# Altium project 4ADI_2DO.PrjPCB (part 4 of 6)

## Sheet power supply.SchDoc
size A3
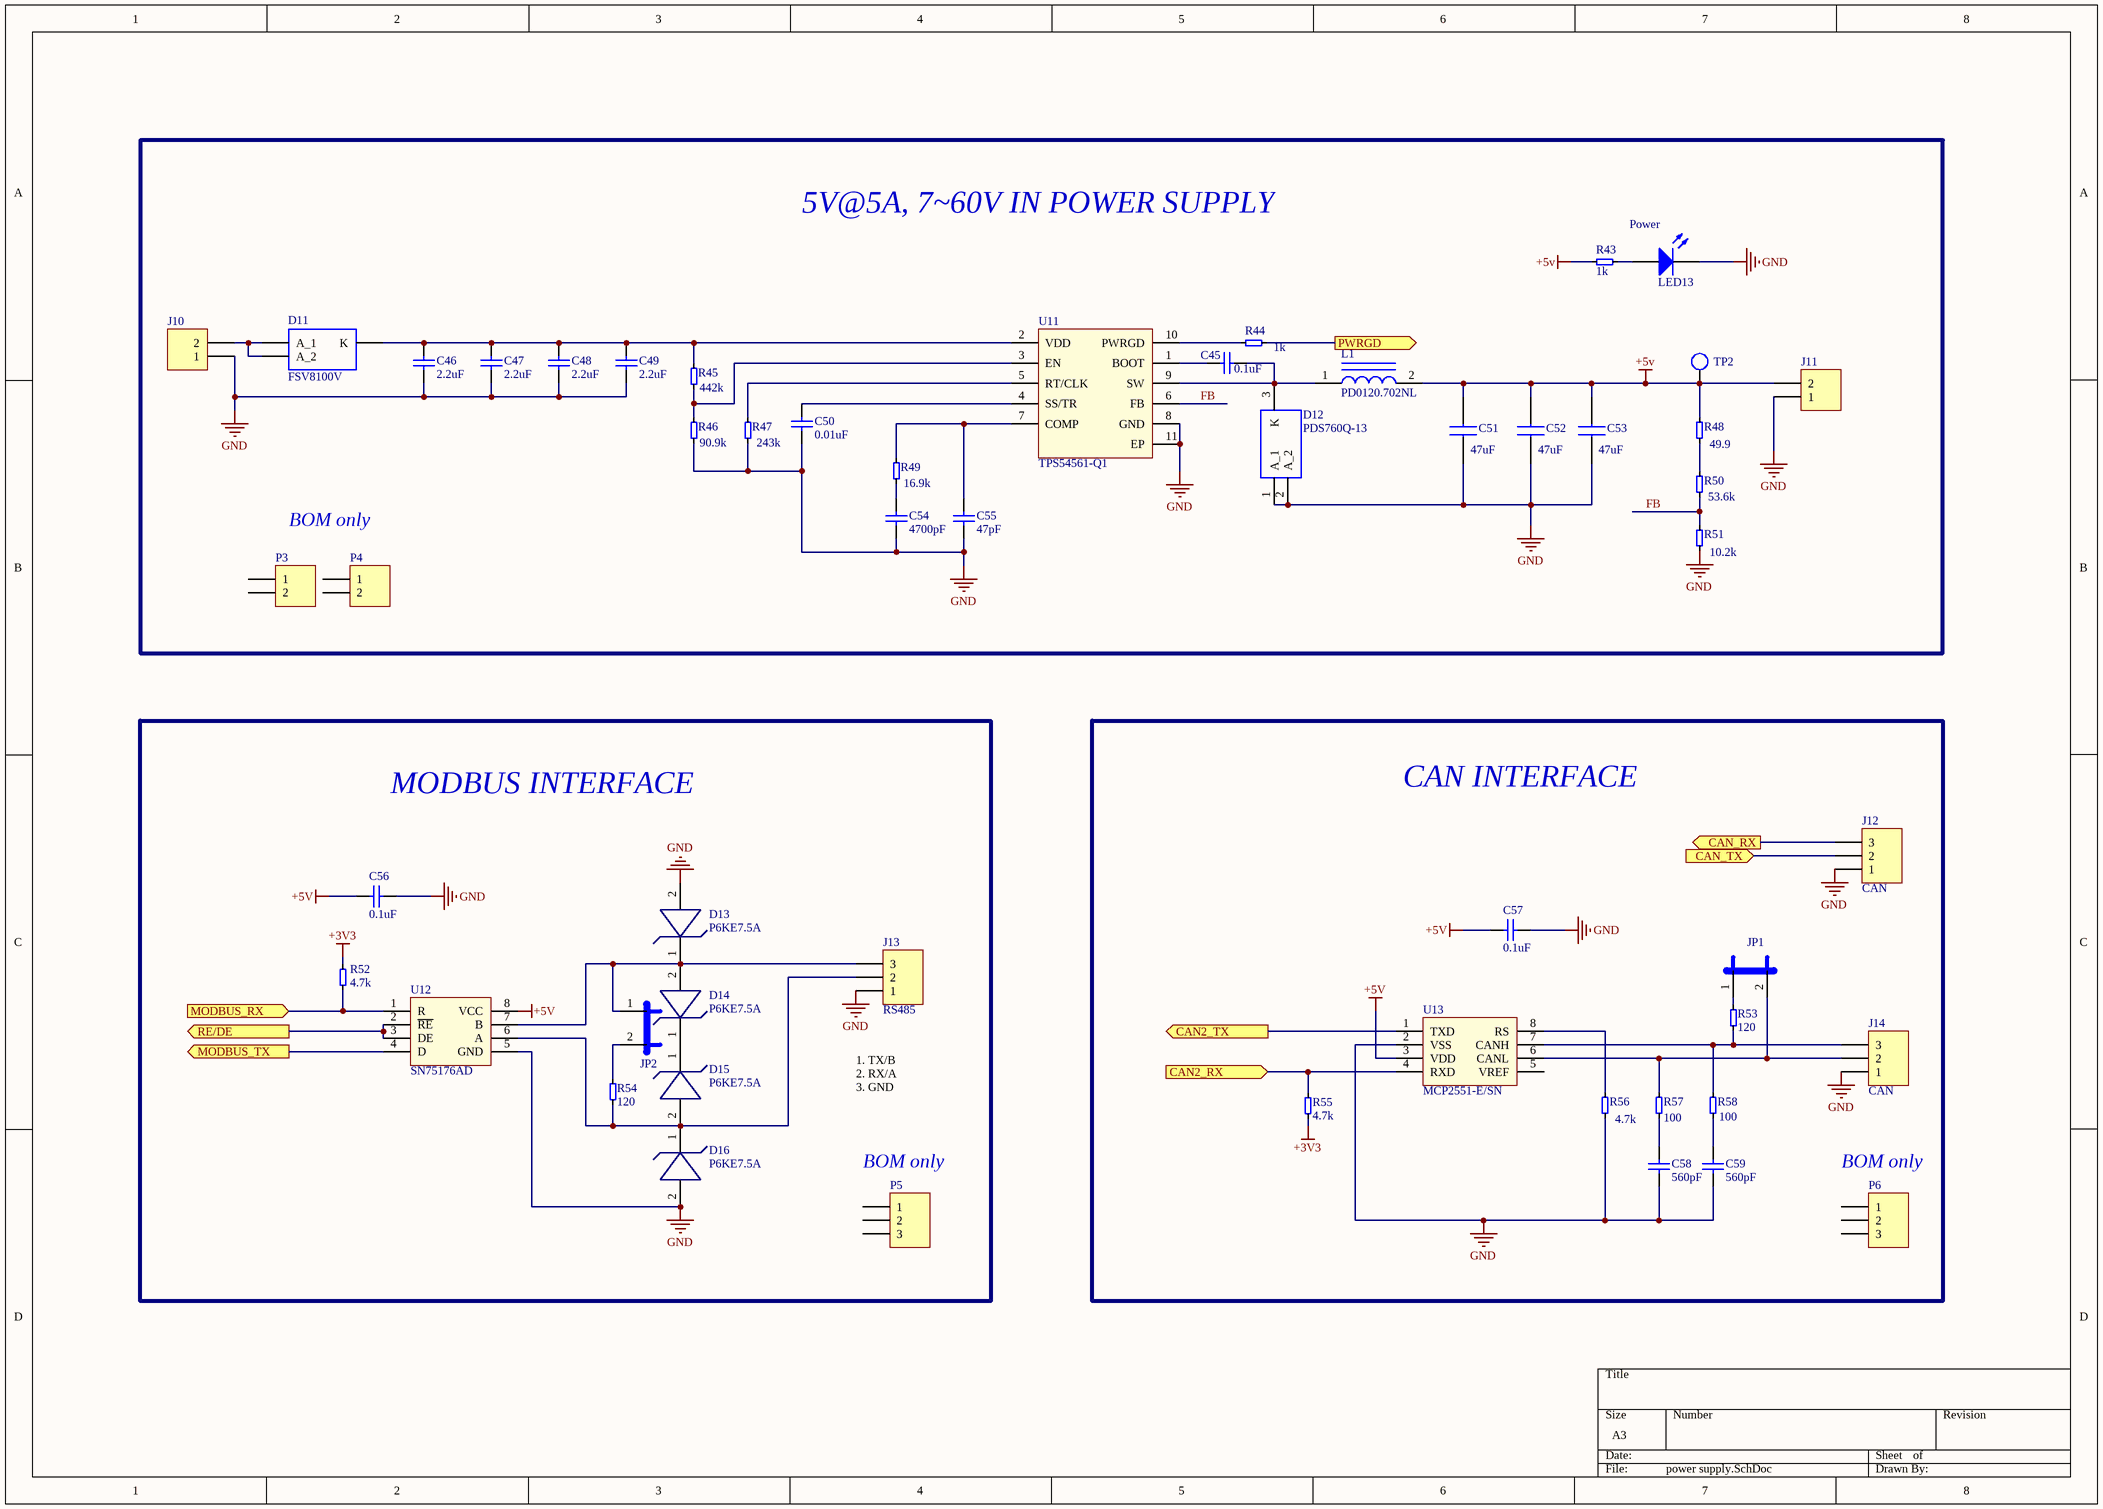
[diagram p4: power supply.SchDoc]

### Parts
C45  0.1uF  [C_ceramic_0603]
C46  2.2uF  [C1210]
C47  2.2uF  [C1210]
C48  2.2uF  [C1210]
C49  2.2uF  [C1210]
C50  0.01uF  [C0603]
C51  47uF  [C1210]
C52  47uF  [C1210]
C53  47uF  [C1210]
C54  4700pF  [C0603]
C55  47pF  [C0603]
C56  0.1uF  [C_ceramic_0603]
C57  0.1uF  [C_ceramic_0603]
C58  560pF  [C0603]
C59  560pF  [C0603]
D11  FSV8100V  [TO-277]
D12  PDS760Q-13  [POWERDI5]
D13  P6KE7.5A  [P6KE7.5A]
D14  P6KE7.5A  [P6KE7.5A]
D15  P6KE7.5A  [P6KE7.5A]
D16  P6KE7.5A  [P6KE7.5A]
J10  CIM025P5  [CON2_P5.08_CIM025P5]  (value not drawn)
J11  CIM025P5  [CON2_P5.08_CIM025P5]  (value not drawn)
J12  CAN  [HDR1X3]
J13  RS485  [CON3_P5.08_CIM035P5]
J14  CAN  [CON3_P5.08_CIM035P5]
JP1  2PIN JUMP_2.54mm  [CNN 2PIN 2.54 JUMP]  (value not drawn)
JP2  2PIN JUMP_2.54mm  [CNN 2PIN 2.54 JUMP]  (value not drawn)
L1  PD0120.702NL  [PD0120.702NL]
LED13  Power  [LED0603_1]
P3  BOM ONLY  (value not drawn)  (mechanical)
P4  BOM ONLY  (value not drawn)  (mechanical)
P5  BOM only_1  (value not drawn)
P6  BOM only_1  (value not drawn)
R43  1k  [R_0603]
R44  1k  [R_0603]
R45  442k  [R_0603]
R46  90.9k  [R_0603]
R47  243k  [R_0603]
R48  49.9  [R_0603]
R49  16.9k  [R_0603]
R50  53.6k  [R_0603]
R51  10.2k  [R_0603]
R52  4.7k  [R_0603]
R53  120  [R_0603]
R54  120  [R_0603]
R55  4.7k  [R_0603]
R56  4.7k  [R_0603]
R57  100  [R_0603]
R58  100  [R_0603]
TP2  Test point  [TP]  (value not drawn)  (no BOM)
U11  TPS54561-Q1  [SON80P400X400X80-11N]
U12  SN75176AD  [SOIC127P600X175-8N]
U13  MCP2551-E/SN  [SOIC127P600X175-8N]

### Ports
CAN2_RX (in), CAN2_TX (out), CAN_RX (out), CAN_TX (in), MODBUS_RX (in), MODBUS_TX (out), PWRGD (out), RE/DE (out)

### Nets
+3V3: R52.2 R55.2
+5v: C51.2(-) C52.2(-) C53.2(-) C56.2 C57.2 J11.2 L1.2 R43.2 R48.2 TP2.1(TP) U12.8(VCC) U13.3(VDD)
GND: C46.1 C47.1 C48.1 C49.1 C50.1 C51.1(+) C52.1(+) C53.1(+) C54.1 C55.1 C56.1 C57.1 C58.1 C59.1 D12.1(A_1) D12.2(A_2) D13.2(NC) D16.2(NC) J10.1 J11.1 J12.1 J13.1 J14.1 LED13.2(K) R46.1 R47.1 R51.1 R56.1 U11.8(GND) U11.11(EP) U12.5(GND) U13.2(VSS)
FB: R50.1 R51.2 U11.6(FB)
NetC45_1: C45.1 U11.1(BOOT)
NetC45_2: C45.2 D12.3(K) L1.1 U11.9(SW)
NetC46_2: C46.2 C47.2 C48.2 C49.2 D11.2(K) R45.2 U11.2(VDD)
NetC50_2: C50.2 U11.4(SS/TR)
NetC54_2: C54.2 R49.1
NetC55_2: C55.2 R49.2 U11.7(COMP)
NetC58_2: C58.2 R57.1
NetC59_2: C59.2 R58.1
NetD11_1: D11.1(A_1) J10.2
NetD13_1: D13.1(K) D14.2(NC) J13.3 JP2.1 U12.7(B)
NetD14_1: D14.1(K) D15.1(K)
NetD15_2: D15.2(NC) D16.1(K) J13.2 R54.1 U12.6(A)
NetJ12_2: J12.2 ; port CAN_TX
NetJ12_3: J12.3 ; port CAN_RX
NetJ14_2: J14.2 JP1.2 R57.2 U13.6(CANL)
NetJ14_3: J14.3 R53.1 R58.2 U13.7(CANH)
NetJP1_1: JP1.1 R53.2
NetJP2_2: JP2.2 R54.2
NetLED13_1: LED13.1(A) R43.1
NetR44_1: R44.1 ; port PWRGD
NetR44_2: R44.2 U11.10(PWRGD)
NetR45_1: R45.1 R46.2 U11.3(EN)
NetR47_2: R47.2 U11.5(RT/CLK)
NetR48_1: R48.1 R50.2
NetR52_1: R52.1 U12.1(R) ; port MODBUS_RX
NetR55_1: R55.1 U13.4(RXD) ; port CAN2_RX
NetR56_2: R56.2 U13.8(RS)
NetU3_60: U12.2(~{RE}) U12.3(DE) ; port RE/DE
NetU3_62: U12.4(D) ; port MODBUS_TX
NetU3_79: U13.1(TXD) ; port CAN2_TX

Not connected (* = marked no-connect by the designer): P3 1 2; P4 1 2; P5 1 2 3; P6 1 2 3; U13 5(VREF)

### Notes on the sheet
- 5V@5A, 7~60V IN POWER SUPPLY
- BOM only
- MODBUS INTERFACE
- CAN INTERFACE
- 1. TX/B
  2. RX/A
  3. GND
- (near P5) BOM only
- (near P6) BOM only

### Library data of the parts
C45 C56 C57 = Cap: CAP CER 0.1UF 50V X7R 0603; Manufacturer: Yageo; Manufacturer Part Number: CC0603KPX7R9BB104; Supplier 1: Digi-Key; Supplier Part Number 1: 311-3567-1-ND
C46-C49 = Cap: CAP CER 2.2UF 100V X7R 1210; Manufacturer: Kyocera AVX; Manufacturer Part Number: 12101C225KAT2A; Tolerance: 10%; Dissipation Factor: 2.5%; Supplier 1: Digi-Key; Supplier Part Number 1: 478-7974-1-ND; Stock 1: 31402; Pricing 1: 1=0.8, 10=0.563, 100=0.3708, 500=0.27464 (USD); Mount: Surface Mount; Case/Package: 1210; Number of Pins: 2; Case Code (Imperial): 1210; Case Code (Metric): 3225; Contact Plating: Tin,Matte; Min Operating Temperature: -55°C; Max Operating Temperature: 125°C; Voltage Rating: 100V; Capacitance: 2.2uF; Package Quantity: 1; Voltage Rating (DC): 100V; Packaging: Tape and Reel; Dielectric: X7R; Termination: SMD/SMT; Voltage: 100V; Length: 3.2mm; Height: 2.79mm; Width: 2.5mm; Thickness: 0.11inch; Depth: 2.5mm; Radiation Hardening: No; Lead Free: Lead Free; REACH SVHC: No SVHC; ComponentLink1URL: http://www.farnell.com/datasheets/1818074.pdf?src-supplier=Element14; ComponentLink1Description: http://www.farnell.com/datasheets/1818074.pdf?src-supplier=Element14; ComponentLink2URL: http://catalogs.avx.com/SurfaceMount.pdf?src-supplier=Digi-Key; ComponentLink2Description: http://catalogs.avx.com/SurfaceMount.pdf?src-supplier=Digi-Key; ComponentLink3URL: http://www.farnell.com/datasheets/1679506.pdf?src-supplier=Element14; ComponentLink3Description: http://www.farnell.com/datasheets/1679506.pdf?src-supplier=Element14
C50 = Cap: CAP CER 10000PF 50V X7R 0603; Manufacturer: Yageo; Manufacturer Part Number: CC0603KRX7R9BB103; Material: Ceramic; Tolerance: 10%; Capacitance: 10nF; Insulation Resistance: 100GR; Supplier 1: Digi-Key; Supplier Part Number 1: 311-1085-1-ND; Stock 1: 8825071; Pricing 1: 1=0.1, 10=0.057, 100=0.0256, 500=0.01826, 1000=0.01435 (USD); Mount: Surface Mount; Case/Package: 0603; Number of Pins: 2; Case Code (Metric): 1608; Case Code (Imperial): 0603; Min Operating Temperature: -55°C; Max Operating Temperature: 125°C; Packaging: Tape and Reel; Voltage Rating: 50V; Voltage Rating (DC): 50V; Package Quantity: 1; Dielectric: X7R; Termination: SMD/SMT; Composition: Ceramic; Voltage: 50V; Length: 1.6mm; Height: 0.8mm; Width: 0.031inch; Thickness: 0.035inch; Depth: 0.8mm; Radiation Hardening: No; REACH SVHC: No SVHC; Lead Free: Lead Free; Halogen Free: Halogen Free; ComponentLink1URL: http://www.farnell.com/datasheets/1734573.pdf?src-supplier=Element14; ComponentLink1Description: http://www.farnell.com/datasheets/1734573.pdf?src-supplier=Element14; ComponentLink2URL: http://www.yageo.com/documents/recent/UPY-GPHC_X7R_6.3V-to-50V_18.pdf?src-supplier=Digi-Key; ComponentLink2Description: http://www.yageo.com/documents/recent/UPY-GPHC_X7R_6.3V-to-50V_18.pdf?src-supplier=Digi-Key; ComponentLink3URL: http://www.farnell.com/datasheets/2167236.pdf?src-supplier=Mouser; ComponentLink3Description: http://www.farnell.com/datasheets/2167236.pdf?src-supplier=Mouser; ComponentLink4URL: http://www.farnell.com/datasheets/70765.pdf?src-supplier=Element14; ComponentLink4Description: http://www.farnell.com/datasheets/70765.pdf?src-supplier=Element14; ComponentLink5URL: http://www.yageo.com/documents/recent/UPY-GPHC_X7R_6.3V-to-50V_8.pdf?src-supplier=Avnet+Europe; ComponentLink5Description: http://www.yageo.com/documents/recent/UPY-GPHC_X7R_6.3V-to-50V_8.pdf?src-supplier=Avnet+Europe; ComponentLink6URL: http://www.farnell.com/datasheets/1489800.pdf?src-supplier=Element14; ComponentLink6Description: http://www.farnell.com/datasheets/1489800.pdf?src-supplier=Element14; ComponentLink7URL: https://www.verical.com/server-webapp/html/getDatasheet?partID=403582&src-supplier=Verical; ComponentLink7Description: https://www.verical.com/server-webapp/html/getDatasheet?partID=403582&src-supplier=Verical
C51-C53 = CAP_UPW1A470MDD1TD: CAP CER 47UF 10V X5R 1210; Manufacturer: Samsung; Manufacturer Part Number: CL32A476MPJNNNE; Tolerance: 20%; Supplier 1: Digi-Key; Supplier Part Number 1: 1276-3380-1-ND; Stock 1: 335104; Pricing 1: 1=0.82, 10=0.602, 100=0.4126, 500=0.32666 (USD); Mount: Surface Mount; Case/Package: 1210; Case Code (Metric): 3225; Case Code (Imperial): 1210; Min Operating Temperature: -55°C; Max Operating Temperature: 85°C; Capacitance: 47uF; Packaging: Tape and Reel; Package Quantity: 1; Voltage Rating: 10V; Dielectric: X5R; Length: 0.126inch; Width: 0.098inch; Thickness: 0.106inch; Depth: 2.5mm; Radiation Hardening: No; ComponentLink1URL: https://www.verical.com/server-webapp/html/getDatasheet?partID=746464&src-supplier=Verical; ComponentLink1Description: https://www.verical.com/server-webapp/html/getDatasheet?partID=746464&src-supplier=Verical; ComponentLink2URL: http://www.samsungsem.com/kr/support/product-search/mlcc/CL32A476MPJNNNE.jsp?src-supplier=Digi-Key; ComponentLink2Description: http://www.samsungsem.com/kr/support/product-search/mlcc/CL32A476MPJNNNE.jsp?src-supplier=Digi-Key
C54 = Cap: CAP CER 4700PF 50V X7R 0603; Manufacturer: Yageo; Manufacturer Part Number: CC0603KRX7R9BB472; Material: Ceramic; Capacitance: 4.7nF; Tolerance: 10%; Insulation Resistance: 10GR; Dissipation Factor: 2.5%; Supplier 1: Digi-Key; Supplier Part Number 1: 311-1083-1-ND; Stock 1: 858972; Pricing 1: 1=0.1, 10=0.057, 100=0.0256, 500=0.01826, 1000=0.01435 (USD); Mount: Surface Mount; Case/Package: 0603; Number of Pins: 2; Case Code (Imperial): 0603; Case Code (Metric): 1608; Dielectric Material: Ceramic; Min Operating Temperature: -55°C; Max Operating Temperature: 125°C; Package Quantity: 1; Voltage Rating: 50V; Voltage Rating (DC): 50V; Packaging: Tape and Reel; Dielectric: X7R; Termination: SMD/SMT; Composition: Ceramic; Voltage: 50V; Length: 1.6mm; Height: 0.8mm; Width: 0.8mm; Thickness: 0.035inch; Depth: 0.8mm; Radiation Hardening: No; REACH SVHC: Unknown; Lead Free: Lead Free; Halogen Free: Halogen Free; ComponentLink1URL: http://www.yageo.com/documents/recent/UPY-GPHC_X7R_6.3V-to-50V_8.pdf?src-supplier=Avnet; ComponentLink1Description: http://www.yageo.com/documents/recent/UPY-GPHC_X7R_6.3V-to-50V_8.pdf?src-supplier=Avnet; ComponentLink2URL: http://www.yageo.com/documents/recent/UPY-GPHC_X7R_6.3V-to-50V_18.pdf?src-supplier=Digi-Key; ComponentLink2Description: http://www.yageo.com/documents/recent/UPY-GPHC_X7R_6.3V-to-50V_18.pdf?src-supplier=Digi-Key; ComponentLink3URL: http://www.yageo.com/documents/recent/UPY-GPHC_X7R_6.3V-to-50V_8.pdf?src-supplier=Avnet+Europe; ComponentLink3Description: http://www.yageo.com/documents/recent/UPY-GPHC_X7R_6.3V-to-50V_8.pdf?src-supplier=Avnet+Europe; ComponentLink4URL: http://www.farnell.com/datasheets/1489800.pdf?src-supplier=Element14; ComponentLink4Description: http://www.farnell.com/datasheets/1489800.pdf?src-supplier=Element14
C55 = Cap: CAP CER 47PF 50V C0G/NPO 0603; Manufacturer: Yageo Phycomp; Manufacturer Part Number: CC0603JRNPO9BN470; Tolerance: 5%; Dielectric: C0G; Temperature Coefficient: 30ppm/°C; Insulation Resistance: 100GR; Supplier 1: Digi-Key; Supplier Part Number 1: 311-1065-1-ND; Stock 1: 429252; Pricing 1: 1=0.1, 10=0.061, 100=0.0273, 500=0.01948, 1000=0.0153 (USD); Mount: Surface Mount; Case/Package: 0603; Number of Pins: 2; Case Code (Imperial): 0603; Case Code (Metric): 1608; Min Operating Temperature: -55°C; Max Operating Temperature: 125°C; Voltage Rating: 50V; Packaging: Tape and Reel; Capacitance: 47pF; Package Quantity: 1; Voltage Rating (DC): 50V; Termination: SMD/SMT; Composition: Ceramic; Voltage: 50V; Length: 1.6mm; Height: 0.8mm; Width: 0.8mm; Thickness: 0.035inch; Depth: 0.8mm; Radiation Hardening: No; REACH SVHC: No SVHC; Lead Free: Lead Free; ComponentLink1URL: http://www.yageo.com/documents/recent/UPY-GP_NP0_16V-to-50V_8.pdf?src-supplier=Avnet; ComponentLink1Description: http://www.yageo.com/documents/recent/UPY-GP_NP0_16V-to-50V_8.pdf?src-supplier=Avnet; ComponentLink2URL: http://www.farnell.com/datasheets/1443161.pdf?src-supplier=Element14; ComponentLink2Description: http://www.farnell.com/datasheets/1443161.pdf?src-supplier=Element14; ComponentLink3URL: http://www.farnell.com/datasheets/1132289.pdf?src-supplier=Farnell; ComponentLink3Description: http://www.farnell.com/datasheets/1132289.pdf?src-supplier=Farnell; ComponentLink4URL: http://www.yageo.com/documents/recent/UPY-GP_NP0_16V-to-50V_16.pdf?src-supplier=Digi-Key; ComponentLink4Description: http://www.yageo.com/documents/recent/UPY-GP_NP0_16V-to-50V_16.pdf?src-supplier=Digi-Key
C58 C59 = Cap: CAP CER 560PF 50V NPO 0603; Manufacturer: Yageo; Manufacturer Part Number: CC0603JRNPO9BN561; Dielectric Material: Ceramic; Tolerance: 5%; Dielectric: C0G; Insulation Resistance: 10GR; Dissipation Factor: 0.1%; Supplier 1: Digi-Key; Supplier Part Number 1: 311-3359-1-ND; Stock 1: 49433; Pricing 1: 1=0.13, 10=0.093, 100=0.0438, 500=0.03074, 1000=0.02545 (USD); Mount: Surface Mount; Case/Package: 0603; Case Code (Imperial): 0603; Case Code (Metric): 1608; Min Operating Temperature: -55°C; Max Operating Temperature: 125°C; Voltage Rating: 50V; Capacitance: 560pF; Voltage Rating (DC): 50V; Packaging: Tape and Reel; Termination: SMD/SMT; Composition: Ceramic; Length: 1.6mm; Height: 0.8mm; Width: 0.8mm; Thickness: 0.035inch; Depth: 0.8mm; Radiation Hardening: No; REACH SVHC: Unknown; Lead Free: Lead Free; ComponentLink1URL: http://www.yageo.com/documents/recent/UPY-GP_NP0_16V-to-50V_8.pdf?src-supplier=Avnet; ComponentLink1Description: http://www.yageo.com/documents/recent/UPY-GP_NP0_16V-to-50V_8.pdf?src-supplier=Avnet; ComponentLink2URL: https://www.verical.com/server-webapp/html/getDatasheet?partID=403539&src-supplier=Verical; ComponentLink2Description: https://www.verical.com/server-webapp/html/getDatasheet?partID=403539&src-supplier=Verical; ComponentLink3URL: http://www.farnell.com/datasheets/1443161.pdf?src-supplier=Element14; ComponentLink3Description: http://www.farnell.com/datasheets/1443161.pdf?src-supplier=Element14
D11 = PDS760Q-13: DIODE SCHOTTKY 100V 8A TO-277; Manufacturer: ON; Supplier 1: Digi-Key; Supplier Part Number 1: FSV8100VCT-ND; Manufacturer Part Number: FSV8100V
D12 = PDS760Q-13: DIODE SCHOTTKY 60V 7A POWERDI5; Manufacturer: Diodes; Element Configuration: Single; Forward Voltage: 560mV; Max Forward Surge Current (Ifsm): 275A; Peak Reverse Current: 20mA; Supplier 1: Digi-Key; Supplier Part Number 1: PDS760Q-13DICT-ND; Manufacturer Part Number: PDS760Q-13; Stock 1: 27556; Pricing 1: 1=0.85, 10=0.76, 100=0.5923, 500=0.48926, 1000=0.38625 (USD); Mount: Surface Mount; Number of Pins: 5; Weight: 0.003386oz; Contact Plating: Tin,Matte; Min Operating Temperature: -65°C; Max Operating Temperature: 150°C; Packaging: Tape and Reel; Average Rectified Current: 7A; Max Repetitive Reverse Voltage (Vrrm): 60V; Package Quantity: 5000; Forward Current: 7A; Peak Non-Repetitive Surge Current: 275A; Max Reverse Voltage (DC): 60V
D13-D16 = ZNR_P6KE7.5A: TVS DIODE 6.4V 11.3V DO214AA; Manufacturer: MCC; Manufacturer Part Number: SMBJP6KE7.5A-TP; Test Current: 10mA; Breakdown Voltage: 7.88V; Polarity: Unidirectional; Peak Pulse Power: 600W; Number of Unidirectional Channels: 1; Min Breakdown Voltage: 7.13V; Power Line Protection: No; Peak Pulse Current: 54A; Leakage Current: 500uA; Supplier 1: Digi-Key; Supplier Part Number 1: SMBJP6KE7.5A-TPMSCT-ND; Stock 1: 1412; Pricing 1: 1=0.46, 10=0.359, 25=0.3024, 100=0.246, 250=0.20388, 500=0.16872, 1000=0.12654 (USD); Mount: Surface Mount; Case/Package: SMB; Number of Pins: 2; Min Operating Temperature: -55°C; Max Operating Temperature: 175°C; Packaging: Tape and Reel; Package Quantity: 1; Clamping Voltage: 11.3V; Reverse Standoff Voltage: 6.4V; Composition: Zener; Max Surge Current: 54A; Number of Channels: 1; Termination: SMD/SMT; Reverse Breakdown Voltage: 7.13V; Number of Elements: 1; Radiation Hardening: No; ComponentLink1URL: http://www.mccsemi.com/up_pdf/SMBJP6KE6.8(C)A-SMBJP6KE550(C)A(DO-214AA).pdf?src-supplier=Digi-Key; ComponentLink1Description: http://www.mccsemi.com/up_pdf/SMBJP6KE6.8(C)A-SMBJP6KE550(C)A(DO-214AA).pdf?src-supplier=Digi-Key
J10 J11 = Header 2: TERM BLK 2P SIDE ENT 5.08MM PCB; Manufacturer: Sauro; Manufacturer Part Number: CIM025P5; Supplier 1: Digi-Key
J12 = Header 3: CONN HEADER VERT 3POS 2.54MM; Manufacturer: Wurth Electronics; Manufacturer Part Number: 61300311121; Number of Positions: 3; Gender: Male; Connector Type: Male Pin; Pitch: 0.1inch; Supplier 1: Digi-Key; Supplier Part Number 1: 732-5316-ND; Stock 1: 146403; Pricing 1: 1=0.13, 10=0.106, 25=0.088, 50=0.074, 100=0.067, 1000=0.061 (USD); Mount: Through Hole; Contact Plating: Gold; Contact Material: Copper; Color: Black; Number of Rows: 1; Packaging: Bulk; Termination: Solder; Number of Contacts: 3; Contact Mating Length: 0.236inch; REACH SVHC: Unknown; Lead Free: Lead Free
J13 J14 P5 P6 = Header 3: Manufacturer: Sauro; Manufacturer Part Number: CIM035P5; Supplier 1: Digi-Key
JP1 JP2 = 2PIN JUMP_2.54mm: CONN HEADER VERT 2POS 2.54MM; Manufacturer: Wurth Electronics; Manufacturer Part Number: 61300211121; Current Rating: 3A; Voltage Rating: 250V; Number of Positions: 2; Gender: Male; Connector Type: Male Pin; Pitch: 0.1inch; Supplier 1: Digi-Key; Supplier Part Number 1: 732-5315-ND; Stock 1: 173337; Pricing 1: 1=0.13, 10=0.106, 25=0.088, 50=0.074, 100=0.067, 1000=0.061 (USD); Mount: Through Hole; Contact Plating: Gold; Housing Material: PBT; Contact Material: Copper Alloy,Copper; Color: Black; Min Operating Temperature: -40°C; Max Operating Temperature: 125°C; Number of Rows: 1; Contact Gender: Male; Packaging: Bulk; Termination: Through Hole; Number of Contacts: 2; Contact Mating Length: 0.236inch; REACH SVHC: Unknown; Lead Free: Lead Free; ComponentLink1URL: http://www.mouser.com/ds/2/445/6130xx11121-538006.pdf?src-supplier=Mouser; ComponentLink1Description: http://www.mouser.com/ds/2/445/6130xx11121-538006.pdf?src-supplier=Mouser
L1 = Inductor Iron: FIXED IND 7.2UH 8.6A 10 MOHM SMD; Manufacturer: Pulse Electronics; Saturation Current: 12.6A; Tolerance: 10%; Shielding: Unshielded; DC Resistance (DCR): 10mR; Supplier 1: Digi-Key; Supplier Part Number 1: 553-2683-ND; Manufacturer Part Number: PD0120.702NL; Stock 1: 1139; Pricing 1: 1=2.93, 90=2.115, 180=1.89, 540=1.53, 1080=1.395, 2520=1.35 (USD); Mount: Surface Mount; Case/Package: Nonstandard; Min Operating Temperature: -40°C; Max Operating Temperature: 125°C; Packaging: Tray; Package Quantity: 90; Current Rating: 8.6A; Inductance: 7.2uH; Max DC Current: 8.6A; Termination: SMD/SMT; Composition: Wirewound; Length: 0.638inch; Height: 0.323inch; Width: 23.87mm; Height - Seated (Max): 0.323inch; Depth: 15.95mm; Radiation Hardening: No
LED13 = LED_0402: LED YELLOW CLEAR CHIP SMD; Manufacturer: Lite-On Inc.; Manufacturer Part Number: LTST-C193KSKT-5A; Supplier 1: Digi-Key; Supplier Part Number 1: 160-1831-1-ND
P3 P4 = Header 2: Plug; Manufacturer: Sauro; Manufacturer Part Number: CIF02005; Supplier 1: Digi-Key
R43 R44 = R_0402: RES SMD 1K OHM 1% 1/10W 0603; Manufacturer: Yageo; Manufacturer Part Number: RC0603FR-071KL; ComponentLink1URL: http://documents.rs-components.com/techlib://itc_doclist_GB.htm?stockno=6186122&src-supplier=RSComponents; ComponentLink1Description: http://documents.rs-components.com/techlib://itc_doclist_GB.htm?stockno=6186122&src-supplier=RSComponents; ComponentLink2URL: http://www.mouser.com/ds/2/447/PYu-RC0402_51_RoHS_L_6_r-8721.pdf?src-supplier=Mouser; ComponentLink2Description: http://www.mouser.com/ds/2/447/PYu-RC0402_51_RoHS_L_6_r-8721.pdf?src-supplier=Mouser; ComponentLink3URL: http://www.yageo.com/documents/recent/PYu-RC0402_51_RoHS_L_6_r.pdf?src-supplier=Future+Electronics; ComponentLink3Description: http://www.yageo.com/documents/recent/PYu-RC0402_51_RoHS_L_6_r.pdf?src-supplier=Future+Electronics; ComponentLink4URL: http://www.farnell.com/datasheets/1018594.pdf?src-supplier=Element14; ComponentLink4Description: http://www.farnell.com/datasheets/1018594.pdf?src-supplier=Element14; ComponentLink5URL: http://www.farnell.com/datasheets/2167052.pdf?src-supplier=Element14; ComponentLink5Description: http://www.farnell.com/datasheets/2167052.pdf?src-supplier=Element14; Supplier 1: Digi-Key; Supplier Part Number 1: 311-1.00KHRCT-ND
R45 = R_0402: RES SMD 442K OHM 1% 1/10W 0603; Manufacturer: Yageo; Manufacturer Part Number: RC0603FR-07442KL; Resistance: 442kR; Power Rating: 100mW; Voltage Rating: 50V; Temperature Coefficient: 100ppm/°C; ComponentLink1URL: http://www.yageo.com/documents/recent/PYu-RC_Group_51_RoHS_L_10.pdf?src-supplier=Digi-Key; ComponentLink1Description: http://www.yageo.com/documents/recent/PYu-RC_Group_51_RoHS_L_10.pdf?src-supplier=Digi-Key; ComponentLink2URL: http://www.yageo.com/documents/recent/PYu-RC0402_51_RoHS_L_6.pdf?src-supplier=Avnet+Europe; ComponentLink2Description: http://www.yageo.com/documents/recent/PYu-RC0402_51_RoHS_L_6.pdf?src-supplier=Avnet+Europe; ComponentLink3URL: http://www.yageo.com/pdf/PYu-RC0402_51_RoHS_L_4.pdf?src-supplier=Avnet; ComponentLink3Description: http://www.yageo.com/pdf/PYu-RC0402_51_RoHS_L_4.pdf?src-supplier=Avnet; Supplier 1: Digi-Key; Supplier Part Number 1: 311-442KHRCT-ND; Stock 1: 227853; Pricing 1: 1=0.1, 10=0.023, 100=0.0094, 1000=0.00421, 2500=0.00366 (USD); Case/Package: 0603; Case Code (Metric): 1608; Case Code (Imperial): 0603; Min Operating Temperature: -55°C; Max Operating Temperature: 155°C; Tolerance: 1%; Package Quantity: 1; Packaging: Tape and Reel; Composition: Thick Film; Number of Terminations: 2; Termination: SMD/SMT; Military Standard: Not; Max Power Dissipation: 100mW; Voltage Rating (DC): 50V; Features: Moisture Resistant; Length: 1.6mm; Height: 0.022inch; Width: 0.031inch; Depth: 0.8mm; Lead Free: Lead Free; ComponentLink4URL: http://www.yageo.com/documents/recent/PYu-RC_Group_51_RoHS_L_9.pdf?src-supplier=Digi-Key; ComponentLink4Description: http://www.yageo.com/documents/recent/PYu-RC_Group_51_RoHS_L_9.pdf?src-supplier=Digi-Key; ComponentLink5URL: http://www.mouser.com/catalog/specsheets/RC0603.pdf?src-supplier=Mouser; ComponentLink5Description: http://www.mouser.com/catalog/specsheets/RC0603.pdf?src-supplier=Mouser
R46 = R_0402: RES SMD 90.9K OHM 1% 1/10W 0603; Manufacturer: Yageo; Manufacturer Part Number: RC0603FR-0790K9L; Resistance: 90.9kR; Voltage Rating (DC): 50V; Power Rating: 100mW; Voltage Rating: 75V; Temperature Coefficient: 100ppm/°C; ComponentLink1URL: http://www.yageo.com/documents/recent/PYu-RC_Group_51_RoHS_L_9.pdf?src-supplier=Verical; ComponentLink1Description: http://www.yageo.com/documents/recent/PYu-RC_Group_51_RoHS_L_9.pdf?src-supplier=Verical; ComponentLink2URL: http://www.yageo.com/documents/recent/PYu-RC_Group_51_RoHS_L_9.pdf?src-supplier=Mouser; ComponentLink2Description: http://www.yageo.com/documents/recent/PYu-RC_Group_51_RoHS_L_9.pdf?src-supplier=Mouser; Supplier 1: Digi-Key; Supplier Part Number 1: 311-90.9KHRCT-ND; Stock 1: 1879816; Pricing 1: 1=0.1, 10=0.023, 100=0.0094, 1000=0.00421, 2500=0.00366 (USD); Case/Package: 0603; Weight: 7.1E-05oz; Case Code (Imperial): 0603; Case Code (Metric): 1608; Min Operating Temperature: -55°C; Max Operating Temperature: 155°C; Tolerance: 1%; Packaging: Tape and Reel; Termination: SMD/SMT; Composition: Thick Film; Military Standard: Not; Length: 1.6mm; Height: 0.45mm; Width: 0.8mm; Depth: 0.8mm; Lead Free: Lead Free; ComponentLink3URL: https://www.verical.com/server-webapp/html/getDatasheet?partID=325203&src-supplier=Verical; ComponentLink3Description: https://www.verical.com/server-webapp/html/getDatasheet?partID=325203&src-supplier=Verical
R47 = R_0402: RES SMD 243K OHM 1% 1/10W 0603; Manufacturer: Yageo; Manufacturer Part Number: RC0603FR-07243KL; Power Rating: 100mW; Resistance: 243kR; Voltage Rating: 50V; Temperature Coefficient: 100ppm/°C; Working Voltage: 75V; ComponentLink1URL: http://www.yageo.com/documents/recent/PYu-RC0402_51_RoHS_L_6.pdf?src-supplier=Avnet; ComponentLink1Description: http://www.yageo.com/documents/recent/PYu-RC0402_51_RoHS_L_6.pdf?src-supplier=Avnet; ComponentLink2URL: http://www.mouser.com/ds/2/447/PYu-RC0402_51_RoHS_L_6_r-8721.pdf?src-supplier=Mouser; ComponentLink2Description: http://www.mouser.com/ds/2/447/PYu-RC0402_51_RoHS_L_6_r-8721.pdf?src-supplier=Mouser; ComponentLink3URL: http://www.yageo.com/documents/recent/PYu-RC0402_51_RoHS_L_6.pdf?src-supplier=Avnet+Europe; ComponentLink3Description: http://www.yageo.com/documents/recent/PYu-RC0402_51_RoHS_L_6.pdf?src-supplier=Avnet+Europe; Supplier 1: Digi-Key; Supplier Part Number 1: 311-243KHRCT-ND; Stock 1: 376039; Pricing 1: 1=0.1, 10=0.023, 100=0.0094, 1000=0.00421, 2500=0.00366 (USD); Case/Package: 0603; Case Code (Imperial): 0603; Case Code (Metric): 1608; Min Operating Temperature: -55°C; Max Operating Temperature: 155°C; Packaging: Tape and Reel; Tolerance: 1%; Termination: SMD/SMT; Composition: Thick Film; Military Standard: Not; Voltage Rating (DC): 50V; Package Quantity: 1; Number of Terminations: 2; Max Power Dissipation: 100mW; Features: Moisture Resistant; Length: 1.6mm; Height: 0.022inch; Width: 0.8mm; Depth: 0.8mm; Lead Free: Lead Free; ComponentLink4URL: http://www.mouser.com/catalog/specsheets/RC0603.pdf?src-supplier=Mouser; ComponentLink4Description: http://www.mouser.com/catalog/specsheets/RC0603.pdf?src-supplier=Mouser; ComponentLink5URL: http://www.yageo.com.tw/exep/pages/download/literatures/PYu-R_INT-thick_7.pdf?src-supplier=Digi-Key; ComponentLink5Description: http://www.yageo.com.tw/exep/pages/download/literatures/PYu-R_INT-thick_7.pdf?src-supplier=Digi-Key; ComponentLink6URL: http://www.yageo.com/documents/recent/PYu-RC_Group_51_RoHS_L_10.pdf?src-supplier=Digi-Key; ComponentLink6Description: http://www.yageo.com/documents/recent/PYu-RC_Group_51_RoHS_L_10.pdf?src-supplier=Digi-Key; ComponentLink7URL: http://www.yageo.com/documents/recent/PYu-RC_Group_51_RoHS_L_9.pdf?src-supplier=Digi-Key; ComponentLink7Description: http://www.yageo.com/documents/recent/PYu-RC_Group_51_RoHS_L_9.pdf?src-supplier=Digi-Key
R48 = R_0402: RES SMD 49.9 OHM 1% 1/10W 0603; Manufacturer: Yageo; Manufacturer Part Number: RC0603FR-0749R9L; Resistance: 49.9R; Power Rating: 100mW; Temperature Coefficient: 100ppm/°C; Voltage Rating (DC): 50V; ComponentLink1URL: http://documents.rs-components.com/techlib://itc_doclist_GB.htm?stockno=6184536&src-supplier=RSComponents; ComponentLink1Description: http://documents.rs-components.com/techlib://itc_doclist_GB.htm?stockno=6184536&src-supplier=RSComponents; ComponentLink2URL: http://www.farnell.com/datasheets/2167052.pdf?src-supplier=Element14; ComponentLink2Description: http://www.farnell.com/datasheets/2167052.pdf?src-supplier=Element14; ComponentLink3URL: http://www.yageo.com/documents/recent/PYu-RC0402_51_RoHS_L_6_r.pdf?src-supplier=Future+Electronics; ComponentLink3Description: http://www.yageo.com/documents/recent/PYu-RC0402_51_RoHS_L_6_r.pdf?src-supplier=Future+Electronics; ComponentLink4URL: http://www.farnell.com/datasheets/1018594.pdf?src-supplier=Element14; ComponentLink4Description: http://www.farnell.com/datasheets/1018594.pdf?src-supplier=Element14; ComponentLink5URL: http://www.yageo.com/documents/recent/PYu-RC_Group_51_RoHS_L_10.pdf?src-supplier=Digi-Key; ComponentLink5Description: http://www.yageo.com/documents/recent/PYu-RC_Group_51_RoHS_L_10.pdf?src-supplier=Digi-Key; Supplier 1: Digi-Key; Supplier Part Number 1: 311-49.9HRCT-ND; Stock 1: 9614882; Pricing 1: 1=0.1, 10=0.023, 100=0.0094, 1000=0.00421, 2500=0.00366 (USD); Case/Package: 0603; Number of Pins: 2; Case Code (Imperial): 0603; Case Code (Metric): 1608; Min Operating Temperature: -55°C; Max Operating Temperature: 155°C; Packaging: Tape and Reel; Tolerance: 1%; Military Standard: Not; Composition: Thick Film; Voltage Rating: 50V; Termination: SMD/SMT; Length: 1.6mm; Height: 0.45mm; Depth: 0.8mm; Lead Free: Lead Free; REACH SVHC: No SVHC; ComponentLink6URL: https://www.verical.com/server-webapp/html/getDatasheet?partID=325421&src-supplier=Verical; ComponentLink6Description: https://www.verical.com/server-webapp/html/getDatasheet?partID=325421&src-supplier=Verical; ComponentLink7URL: http://documents.rs-components.com/techlib://itc_doclist_GB.htm?stockno=5047565&src-supplier=RSComponents; ComponentLink7Description: http://documents.rs-components.com/techlib://itc_doclist_GB.htm?stockno=5047565&src-supplier=RSComponents
R49 = R_0402: RES SMD 16.9K OHM 1% 1/10W 0603; Manufacturer: Yageo; Manufacturer Part Number: RC0603FR-0716K9L; Resistance: 16.9kR; Power Rating: 100mW; Temperature Coefficient: 100ppm/°C; Voltage Rating (DC): 50V; ComponentLink1URL: http://www.yageo.com/documents/recent/PYu-RC0402_51_RoHS_L_6.pdf?src-supplier=Avnet+Europe; ComponentLink1Description: http://www.yageo.com/documents/recent/PYu-RC0402_51_RoHS_L_6.pdf?src-supplier=Avnet+Europe; ComponentLink2URL: http://www.mouser.com/ds/2/447/PYu-RC0402_51_RoHS_L_6_r-8721.pdf?src-supplier=Mouser; ComponentLink2Description: http://www.mouser.com/ds/2/447/PYu-RC0402_51_RoHS_L_6_r-8721.pdf?src-supplier=Mouser; ComponentLink3URL: http://www.yageo.com/documents/recent/PYu-RC0402_51_RoHS_L_6_r.pdf?src-supplier=Future+Electronics; ComponentLink3Description: http://www.yageo.com/documents/recent/PYu-RC0402_51_RoHS_L_6_r.pdf?src-supplier=Future+Electronics; Supplier 1: Digi-Key; Supplier Part Number 1: 311-16.9KHRCT-ND; Stock 1: 886707; Pricing 1: 1=0.1, 10=0.023, 100=0.0094, 1000=0.00421, 2500=0.00366 (USD); Case/Package: 0603; Case Code (Metric): 1608; Case Code (Imperial): 0603; Min Operating Temperature: -55°C; Max Operating Temperature: 155°C; Tolerance: 1%; Packaging: Tape and Reel; Composition: Thick Film; Number of Terminations: 2; Military Standard: Not; Package Quantity: 1; Voltage Rating: 50V; Termination: SMD/SMT; Max Power Dissipation: 100mW; Features: Moisture Resistant; Length: 1.6mm; Height: 0.022inch; Depth: 0.8mm; Width: 0.031inch; Lead Free: Lead Free; ComponentLink4URL: http://www.yageo.com/documents/recent/PYu-RC_Group_51_RoHS_L_9.pdf?src-supplier=Digi-Key; ComponentLink4Description: http://www.yageo.com/documents/recent/PYu-RC_Group_51_RoHS_L_9.pdf?src-supplier=Digi-Key; ComponentLink5URL: http://www.yageo.com/documents/recent/PYu-RC_Group_51_RoHS_L_10.pdf?src-supplier=Digi-Key; ComponentLink5Description: http://www.yageo.com/documents/recent/PYu-RC_Group_51_RoHS_L_10.pdf?src-supplier=Digi-Key; ComponentLink6URL: http://www.mouser.com/catalog/specsheets/RC0603.pdf?src-supplier=Mouser; ComponentLink6Description: http://www.mouser.com/catalog/specsheets/RC0603.pdf?src-supplier=Mouser
R50 = R_0402: RES SMD 53.6K OHM 1% 1/10W 0603; Manufacturer: Yageo; Manufacturer Part Number: RC0603FR-0753K6L; Resistance: 53.6kR; Temperature Coefficient: 100ppm/°C; Voltage Rating (DC): 50V; Power Rating: 100mW; ComponentLink1URL: http://www.yageo.com/documents/recent/PYu-RC0402_51_RoHS_L_6.pdf?src-supplier=Avnet; ComponentLink1Description: http://www.yageo.com/documents/recent/PYu-RC0402_51_RoHS_L_6.pdf?src-supplier=Avnet; ComponentLink2URL: http://www.yageo.com/documents/recent/PYu-RC_Group_51_RoHS_L_10.pdf?src-supplier=Digi-Key; ComponentLink2Description: http://www.yageo.com/documents/recent/PYu-RC_Group_51_RoHS_L_10.pdf?src-supplier=Digi-Key; ComponentLink3URL: http://www.yageo.com/documents/recent/PYu-RC0402_51_RoHS_L_6_r.pdf?src-supplier=Mouser; ComponentLink3Description: http://www.yageo.com/documents/recent/PYu-RC0402_51_RoHS_L_6_r.pdf?src-supplier=Mouser; Supplier 1: Digi-Key; Supplier Part Number 1: 311-53.6KHRCT-ND; Stock 1: 661818; Pricing 1: 1=0.1, 10=0.023, 100=0.0094, 1000=0.00421, 2500=0.00366 (USD); Mount: Surface Mount; Case/Package: 0603; Case Code (Imperial): 0603; Case Code (Metric): 1608; Min Operating Temperature: -55°C; Max Operating Temperature: 155°C; Packaging: Tape and Reel; Tolerance: 1%; Composition: Thick Film; Voltage Rating: 50V; Termination: SMD/SMT; Military Standard: Not; Length: 1.6mm; Height: 0.45mm; Depth: 0.8mm; Lead Free: Lead Free; ComponentLink4URL: http://documents.rs-components.com/techlib://itc_doclist_GB.htm?stockno=5047745&src-supplier=RSComponents; ComponentLink4Description: http://documents.rs-components.com/techlib://itc_doclist_GB.htm?stockno=5047745&src-supplier=RSComponents
R51 = R_0402: RES SMD 10.2K OHM 1% 1/10W 0603; Manufacturer: Yageo; Manufacturer Part Number: RC0603FR-0710K2L; Resistance: 10.2kR; Power Rating: 100mW; Voltage Rating: 75V; Temperature Coefficient: 100ppm/°C; Voltage Rating (DC): 50V; ComponentLink1URL: https://www.verical.com/server-webapp/html/getDatasheet?partID=327827&src-supplier=Verical; ComponentLink1Description: https://www.verical.com/server-webapp/html/getDatasheet?partID=327827&src-supplier=Verical; ComponentLink2URL: http://www.yageo.com/pdf/PYu-RC0402_51_RoHS_L_4.pdf?src-supplier=Avnet; ComponentLink2Description: http://www.yageo.com/pdf/PYu-RC0402_51_RoHS_L_4.pdf?src-supplier=Avnet; ComponentLink3URL: http://www.yageo.com/documents/recent/PYu-RC0402_51_RoHS_L_6.pdf?src-supplier=Avnet+Europe; ComponentLink3Description: http://www.yageo.com/documents/recent/PYu-RC0402_51_RoHS_L_6.pdf?src-supplier=Avnet+Europe; ComponentLink4URL: http://www.yageo.com/documents/recent/PYu-RC0402_51_RoHS_L_6_r.pdf?src-supplier=Future+Electronics; ComponentLink4Description: http://www.yageo.com/documents/recent/PYu-RC0402_51_RoHS_L_6_r.pdf?src-supplier=Future+Electronics; Supplier 1: Digi-Key; Supplier Part Number 1: 311-10.2KHRCT-ND; Stock 1: 691246; Pricing 1: 1=0.1, 10=0.023, 100=0.0094, 1000=0.00421, 2500=0.00366 (USD); Mount: Surface Mount; Case/Package: 0603; Weight: 7.1E-05oz; Case Code (Metric): 1608; Case Code (Imperial): 0603; Min Operating Temperature: -55°C; Max Operating Temperature: 155°C; Tolerance: 1%; Packaging: Tape and Reel; Composition: Thick Film; Termination: SMD/SMT; Military Standard: Not; Package Quantity: 1; Number of Terminations: 2; Max Power Dissipation: 100mW; Features: Moisture Resistant; Length: 1.6mm; Height: 0.45mm; Depth: 0.8mm; Width: 0.031inch; Lead Free: Lead Free; ComponentLink5URL: http://www.yageo.com/documents/recent/PYu-RC_Group_51_RoHS_L_10.pdf?src-supplier=Digi-Key; ComponentLink5Description: http://www.yageo.com/documents/recent/PYu-RC_Group_51_RoHS_L_10.pdf?src-supplier=Digi-Key; ComponentLink6URL: http://documents.rs-components.com/techlib://itc_doclist_GB.htm?stockno=5049022&src-supplier=RSComponents; ComponentLink6Description: http://documents.rs-components.com/techlib://itc_doclist_GB.htm?stockno=5049022&src-supplier=RSComponents
R52 R55 R56 = R_0402: RES SMD 4.7K OHM 1% 1/10W 0603; Manufacturer: Yageo Phycomp; Manufacturer Part Number: RC0603FR-074K7L; Temperature Coefficient: 100ppm/°C; Voltage Rating (DC): 50V; Resistance: 4.7kR; Power Rating: 100mW; ComponentLink1URL: http://documents.rs-components.com/techlib://itc_doclist_GB.htm?stockno=6184558&src-supplier=RSComponents; ComponentLink1Description: http://documents.rs-components.com/techlib://itc_doclist_GB.htm?stockno=6184558&src-supplier=RSComponents; ComponentLink2URL: http://www.farnell.com/datasheets/1018594.pdf?src-supplier=Element14; ComponentLink2Description: http://www.farnell.com/datasheets/1018594.pdf?src-supplier=Element14; ComponentLink3URL: https://www.verical.com/server-webapp/html/getDatasheet?partID=328119&src-supplier=Verical; ComponentLink3Description: https://www.verical.com/server-webapp/html/getDatasheet?partID=328119&src-supplier=Verical; ComponentLink4URL: http://www.farnell.com/datasheets/1686128.pdf?src-supplier=Element14; ComponentLink4Description: http://www.farnell.com/datasheets/1686128.pdf?src-supplier=Element14; Supplier 1: Digi-Key; Supplier Part Number 1: 311-4.70KHRCT-ND; Stock 1: 15266985; Pricing 1: 1=0.1, 10=0.023, 100=0.0094, 1000=0.00421, 2500=0.00366 (USD); Mount: Surface Mount; Case/Package: 0603; Number of Pins: 2; Min Operating Temperature: -55°C; Max Operating Temperature: 155°C; Tolerance: 1%; Packaging: Cut Tape; Length: 1.6mm; Height: 0.45mm; Width: 800um; Depth: 0.8mm; REACH SVHC: No SVHC; Lead Free: Lead Free
R53 R54 = R_0402: RES SMD 120 OHM 1% 1/10W 0603; Manufacturer: Yageo; Manufacturer Part Number: RC0603FR-07120RL; Resistance: 120R; Temperature Coefficient: 100ppm/°C; Voltage Rating (DC): 50V; Power Rating: 100mW; ComponentLink1URL: http://www.farnell.com/datasheets/1018594.pdf?src-supplier=Element14; ComponentLink1Description: http://www.farnell.com/datasheets/1018594.pdf?src-supplier=Element14; ComponentLink2URL: http://www.mouser.com/ds/2/447/PYu-RC0402_51_RoHS_L_6_r-8721.pdf?src-supplier=Mouser; ComponentLink2Description: http://www.mouser.com/ds/2/447/PYu-RC0402_51_RoHS_L_6_r-8721.pdf?src-supplier=Mouser; ComponentLink3URL: http://documents.rs-components.com/techlib://itc_doclist_GB.htm?stockno=6185898&src-supplier=RSComponents; ComponentLink3Description: http://documents.rs-components.com/techlib://itc_doclist_GB.htm?stockno=6185898&src-supplier=RSComponents; ComponentLink4URL: http://www.yageo.com/documents/recent/PYu-RC_Group_51_RoHS_L_10.pdf?src-supplier=Digi-Key; ComponentLink4Description: http://www.yageo.com/documents/recent/PYu-RC_Group_51_RoHS_L_10.pdf?src-supplier=Digi-Key; ComponentLink5URL: http://www.yageo.com/documents/recent/PYu-RC0402_51_RoHS_L_6_r.pdf?src-supplier=Future+Electronics; ComponentLink5Description: http://www.yageo.com/documents/recent/PYu-RC0402_51_RoHS_L_6_r.pdf?src-supplier=Future+Electronics; Supplier 1: Digi-Key; Supplier Part Number 1: 311-120HRCT-ND; Stock 1: 2588202; Pricing 1: 1=0.1, 10=0.023, 100=0.0094, 1000=0.00421, 2500=0.00366 (USD); Case/Package: 0603; Number of Pins: 2; Case Code (Metric): 1608; Case Code (Imperial): 0603; Min Operating Temperature: -55°C; Max Operating Temperature: 155°C; Tolerance: 1%; Composition: Thick Film; Packaging: Tape and Reel; Voltage Rating: 50V; Package Quantity: 1; Number of Terminations: 2; Termination: SMD/SMT; Military Standard: Not; Max Power Dissipation: 100mW; Features: Moisture Resistant; Length: 1.6mm; Height: 0.022inch; Width: 0.031inch; Depth: 0.8mm; REACH SVHC: No SVHC; Lead Free: Lead Free; ComponentLink6URL: http://www.farnell.com/datasheets/2167052.pdf?src-supplier=Element14; ComponentLink6Description: http://www.farnell.com/datasheets/2167052.pdf?src-supplier=Element14; ComponentLink7URL: http://www.farnell.com/datasheets/1868787.pdf?src-supplier=Element14; ComponentLink7Description: http://www.farnell.com/datasheets/1868787.pdf?src-supplier=Element14; ComponentLink8URL: http://www.farnell.com/datasheets/443971.pdf?src-supplier=Element14; ComponentLink8Description: http://www.farnell.com/datasheets/443971.pdf?src-supplier=Element14
R57 R58 = R_0402: RES SMD 100 OHM 1% 1/10W 0603; Manufacturer: Yageo; Manufacturer Part Number: RC0603FR-07100RL; Voltage Rating (DC): 50V; Resistance: 100R; Temperature Coefficient: 100ppm/°C; Power Rating: 100mW; ComponentLink1URL: http://www.farnell.com/datasheets/1784430.pdf?src-supplier=Element14; ComponentLink1Description: http://www.farnell.com/datasheets/1784430.pdf?src-supplier=Element14; ComponentLink2URL: http://www.yageo.com/documents/recent/PYu-RC_Group_51_RoHS_L_9.pdf?src-supplier=Mouser; ComponentLink2Description: http://www.yageo.com/documents/recent/PYu-RC_Group_51_RoHS_L_9.pdf?src-supplier=Mouser; ComponentLink3URL: http://www.yageo.com/documents/recent/PYu-RC0402_51_RoHS_L_6_r.pdf?src-supplier=Future+Electronics; ComponentLink3Description: http://www.yageo.com/documents/recent/PYu-RC0402_51_RoHS_L_6_r.pdf?src-supplier=Future+Electronics; ComponentLink4URL: https://www.verical.com/server-webapp/html/getDatasheet?partID=329466&src-supplier=Verical; ComponentLink4Description: https://www.verical.com/server-webapp/html/getDatasheet?partID=329466&src-supplier=Verical; ComponentLink5URL: http://www.farnell.com/datasheets/1018594.pdf?src-supplier=Element14; ComponentLink5Description: http://www.farnell.com/datasheets/1018594.pdf?src-supplier=Element14; ComponentLink6URL: http://www.farnell.com/datasheets/2167052.pdf?src-supplier=Element14; ComponentLink6Description: http://www.farnell.com/datasheets/2167052.pdf?src-supplier=Element14; ComponentLink7URL: http://documents.rs-components.com/techlib://itc_doclist_GB.htm?stockno=6185810&src-supplier=RSComponents; ComponentLink7Description: http://documents.rs-components.com/techlib://itc_doclist_GB.htm?stockno=6185810&src-supplier=RSComponents; Supplier 1: Digi-Key; Supplier Part Number 1: 311-100HRCT-ND; Stock 1: 22661122; Pricing 1: 1=0.1, 10=0.021, 100=0.0084, 1000=0.00376, 2500=0.00327 (USD); Case/Package: 0603; Number of Pins: 2; Case Code (Imperial): 0603; Case Code (Metric): 1608; Min Operating Temperature: -55°C; Max Operating Temperature: 155°C; Tolerance: 1%; Packaging: Tape and Reel; Composition: Thick Film; Voltage Rating: 50V; Termination: SMD/SMT; Military Standard: Not; Length: 1.6mm; Height: 0.45mm; Width: 0.8mm; Depth: 0.8mm; REACH SVHC: Unknown; Lead Free: Lead Free; ComponentLink8URL: http://www.farnell.com/datasheets/1868787.pdf?src-supplier=Element14; ComponentLink8Description: http://www.farnell.com/datasheets/1868787.pdf?src-supplier=Element14; ComponentLink9URL: http://documents.rs-components.com/techlib://itc_doclist_GB.htm?stockno=5048912&src-supplier=RSComponents; ComponentLink9Description: http://documents.rs-components.com/techlib://itc_doclist_GB.htm?stockno=5048912&src-supplier=RSComponents; ComponentLink10URL: http://www.farnell.com/datasheets/443971.pdf?src-supplier=Element14; ComponentLink10Description: http://www.farnell.com/datasheets/443971.pdf?src-supplier=Element14
U11 = TPS54561-Q1: IC REG BCK SPLIT RAIL ADJ 10WSON; Manufacturer: Texas Instruments; Manufacturer Part Number: TPS54561DPRR; Switching Frequency: 2.5MHz; Number of Outputs: 1; Output Voltage: 59V; Max Output Current: 5A; Min Input Voltage: 4.5V; Max Input Voltage: 60V; Synchronous Rectifier: No; Min Output Voltage: 800mV; Quiescent Current: 152uA; Output Type: Adjustable; Output Configuration: Positive; Supplier 1: Digi-Key; Supplier Part Number 1: 296-40803-1-ND; Stock 1: 14195; Pricing 1: 1=5.52, 10=4.962, 100=4.0652, 500=3.46064, 1000=2.91861 (USD); Mount: Surface Mount; Number of Pins: 10; Min Operating Temperature: -40°C; Max Operating Temperature: 125°C; Package Quantity: 3000; Packaging: Tape and Reel; Output Current: 5A; Max Output Voltage: 59V; Operating Supply Voltage: 60V; Radiation Hardening: No; Lead Free: Lead Free; ComponentLink1URL: http://www.ti.com/lit/ds/symlink/tps54561.pdf?src-supplier=Digi-Key; ComponentLink1Description: http://www.ti.com/lit/ds/symlink/tps54561.pdf?src-supplier=Digi-Key; ComponentLink2URL: http://www.ti.com/lit/ds/symlink/tps54561.pdf?src-supplier=Avnet; ComponentLink2Description: http://www.ti.com/lit/ds/symlink/tps54561.pdf?src-supplier=Avnet
U12 = SN75176AD: IC DIFF BUS TXRX 8-SOIC; Manufacturer: Texas Instruments; Manufacturer Part Number: SN75176ADR; Number of Receivers: 1; Operating Supply Voltage: 5V; Min Supply Voltage: 4.75V; Max Supply Voltage: 5.25V; Nominal Supply Current: 50mA; Data Rate: 10Mbps; Logic Function: Transceiver; Simplex/Duplex: Half Duplex; ESD Protection: No; Supplier 1: Digi-Key; Supplier Part Number 1: 296-14955-1-ND; Stock 1: 24477; Pricing 1: 1=1.46, 10=1.31, 100=1.021, 500=0.84346, 1000=0.6659 (USD); Case/Package: D; Number of Pins: 8; Weight: 0.002561oz; Contact Plating: Gold; Min Operating Temperature: 0°C; Max Operating Temperature: 70°C; Number of Transmitters: 1; Packaging: Tape and Reel; Package Quantity: 1; Number of Drivers: 1; Number of Transceivers: 1; Max Supply Current: 50mA; Length: 4.9mm; Height: 1.58mm; Width: 3.91mm; REACH SVHC: No SVHC; Lead Free: Lead Free; ComponentLink1URL: http://focus.ti.com/lit/ds/symlink/sn75176a.pdf?src-supplier=Avnet+Europe; ComponentLink1Description: http://focus.ti.com/lit/ds/symlink/sn75176a.pdf?src-supplier=Avnet+Europe; ComponentLink2URL: http://www.jameco.com/Jameco/Products/ProdDS/1054027.pdf?src-supplier=Jameco; ComponentLink2Description: http://www.jameco.com/Jameco/Products/ProdDS/1054027.pdf?src-supplier=Jameco; ComponentLink3URL: http://www.ti.com/general/docs/lit/getliterature.tsp?genericPartNumber=SN75176A&&fileType=pdf&src-supplier=Avnet; ComponentLink3Description: http://www.ti.com/general/docs/lit/getliterature.tsp?genericPartNumber=SN75176A&&fileType=pdf&src-supplier=Avnet; ComponentLink4URL: http://www.ti.com/lit/ds/symlink/sn75176a.pdf?src-supplier=Digi-Key; ComponentLink4Description: http://www.ti.com/lit/ds/symlink/sn75176a.pdf?src-supplier=Digi-Key
U13 = MCP2551-E_SN: 1/1 Transceiver Half CANbus 8-SOIC; Manufacturer: Microchip; Interface: CAN,Serial; Operating Supply Voltage: 5V; Data Rate: 1Mbps; Max Supply Voltage: 5.5V; Min Supply Voltage: 4.5V; Nominal Supply Current: 75mA; Number of Receive Buffers: 1; Supplier 1: Digi-Key; Supplier Part Number 1: MCP2551-E/SN-ND; Manufacturer Part Number: MCP2551-E/SN; Stock 1: 15291; Pricing 1: 1=1.22, 25=1.0096, 100=0.9167 (USD); Mount: Surface Mount; Case/Package: SOIC; Number of Pins: 8; Contact Plating: Tin,Matte; Min Operating Temperature: -40°C; Max Operating Temperature: 125°C; Package Quantity: 100; Packaging: Rail/Tube; Number of Transmit Buffers: 1; Max Supply Current: 75mA; Number of Transceivers: 1; Number of Drivers: 1; Number of Receivers: 1; Logic Function: Transceiver; Length: 0.192inch; Height: 0.059inch; Width: 0.154inch; Radiation Hardening: No; REACH SVHC: No SVHC; Lead Free: Lead Free; ComponentLink1URL: http://www.microchip.com/mymicrochip/filehandler.aspx?ddocname=en011797&src-supplier=Future+Electronics; ComponentLink1Description: http://www.microchip.com/mymicrochip/filehandler.aspx?ddocname=en011797&src-supplier=Future+Electronics; ComponentLink2URL: http://www.microchip.com/mymicrochip/filehandler.aspx?ddocname=en023833&src-supplier=Digi-Key; ComponentLink2Description: http://www.microchip.com/mymicrochip/filehandler.aspx?ddocname=en023833&src-supplier=Digi-Key; ComponentLink3URL: http://www.mouser.com/ds/2/268/20001667G-1115479.pdf?src-supplier=Mouser; ComponentLink3Description: http://www.mouser.com/ds/2/268/20001667G-1115479.pdf?src-supplier=Mouser; ComponentLink4URL: https://www.distrelec.biz/Web/Downloads/_t/ds/mcp2551_eng_tds.pdf?mime=application%2Fpdf&src-supplier=Distrelec; ComponentLink4Description: https://www.distrelec.biz/Web/Downloads/_t/ds/mcp2551_eng_tds.pdf?mime=application%2Fpdf&src-supplier=Distrelec; ComponentLink5URL: http://www.farnell.com/datasheets/2299423.pdf?src-supplier=Element14; ComponentLink5Description: http://www.farnell.com/datasheets/2299423.pdf?src-supplier=Element14
TP2 = Test point: Supplier 1: Digi-Key